# Altium schematic sheet USB.SchDoc
size A3; ApprovedBy: D. Grossman; CheckedBy: G. Engel; Author: Y. Yakov; CompanyName: LightSense; DrawnBy: Y. Yakov; Engineer: Y.Yakov; Organization: LightSense
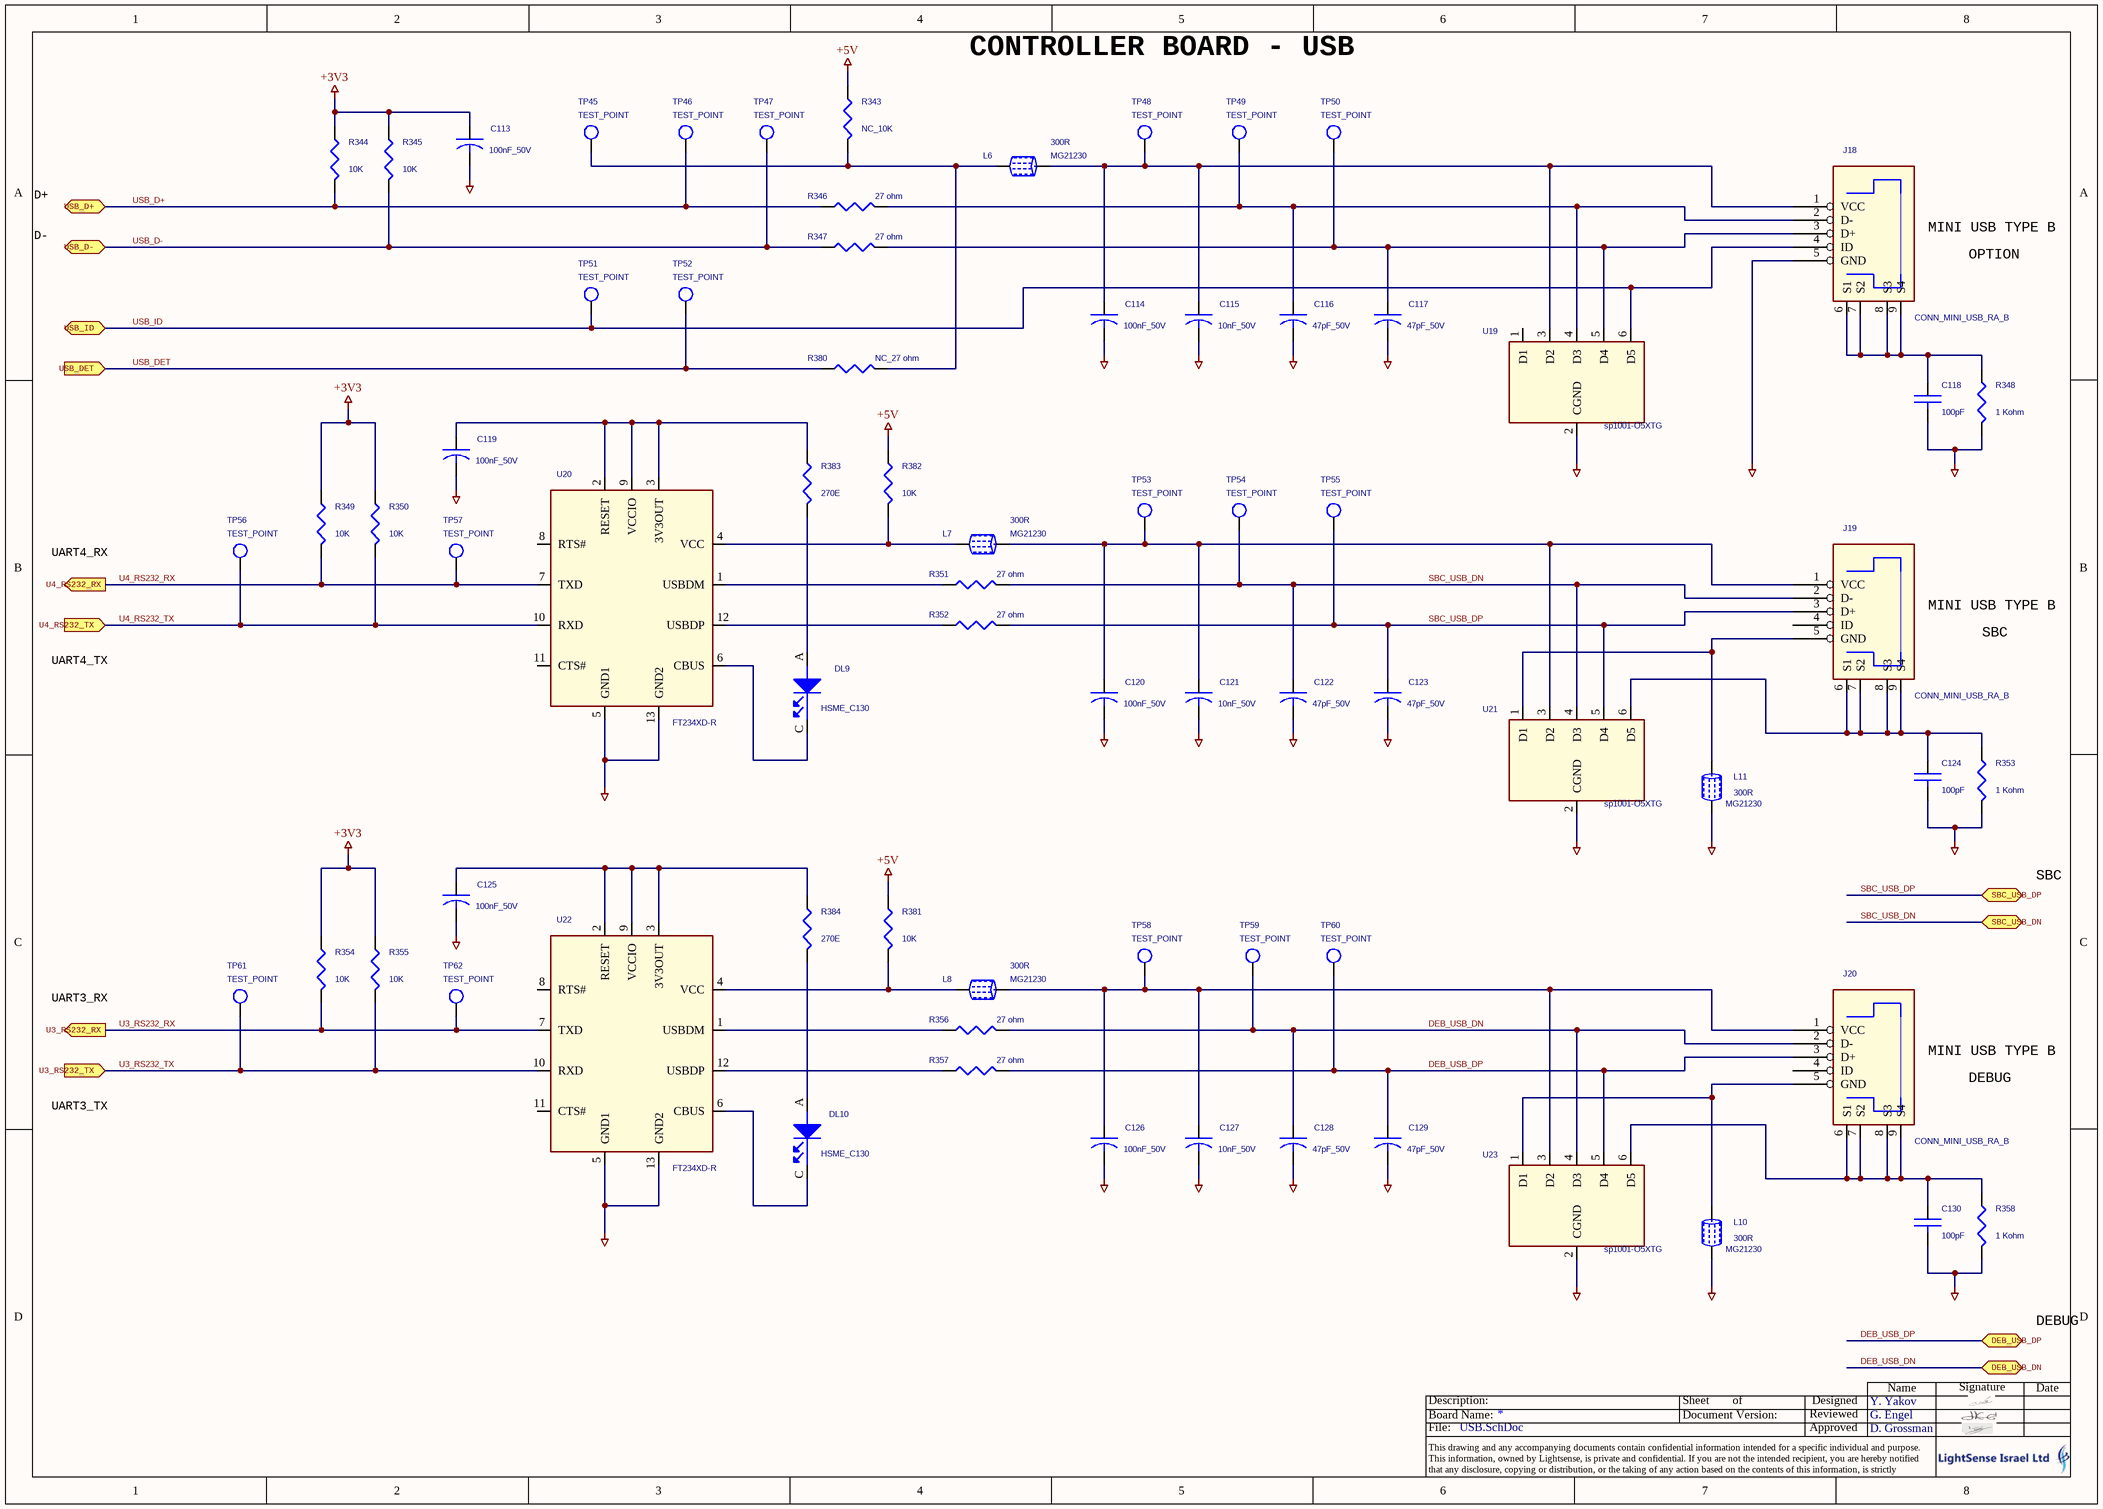
[diagram p0: USB.SchDoc]

## Parts
C113  100nF_50V  [0603]
C114  100nF_50V  [0603]
C115  10nF_50V  [0603]
C116  47pF_50V  [0603]
C117  47pF_50V  [0603]
C118  100pF  [C1206]
C119  100nF_50V  [0603]
C120  100nF_50V  [0603]
C121  10nF_50V  [0603]
C122  47pF_50V  [0603]
C123  47pF_50V  [0603]
C124  100pF  [C1206]
C125  100nF_50V  [0603]
C126  100nF_50V  [0603]
C127  10nF_50V  [0603]
C128  47pF_50V  [0603]
C129  47pF_50V  [0603]
C130  100pF  [C1206]
DL9  HSME_C130  [LED_0603]
DL10  HSME_C130  [LED_0603]
J18  CONN_MINI_USB_RA_B  [MUSB_B_9PIN]
J19  CONN_MINI_USB_RA_B  [MUSB_B_9PIN]
J20  CONN_MINI_USB_RA_B  [MUSB_B_9PIN]
L6  300R  Part_Number: MG21230  [B0603]
L7  300R  Part_Number: MG21230  [B0603]
L8  300R  Part_Number: MG21230  [B0603]
L10  300R  Part_Number: MG21230  [B0603]
L11  300R  Part_Number: MG21230  [B0603]
R343  NC_10K  [0603]
R344  10K  [0603]
R345  10K  [0603]
R346  27 ohm  [R0603]
R347  27 ohm  [R0603]
R348  1 Kohm  [R1206]
R349  10K  [0603]
R350  10K  [0603]
R351  27 ohm  [R0603]
R352  27 ohm  [R0603]
R353  1 Kohm  [R1206]
R354  10K  [0603]
R355  10K  [0603]
R356  27 ohm  [R0603]
R357  27 ohm  [R0603]
R358  1 Kohm  [R1206]
R380  NC_27 ohm  [R0603]
R381  10K  [0603]
R382  10K  [0603]
R383  270E  [0603]
R384  270E  [0603]
TP45  TEST_POINT  [TH_1mm]
TP46  TEST_POINT  [TH_1mm]
TP47  TEST_POINT  [TH_1mm]
TP48  TEST_POINT  [TH_1mm]
TP49  TEST_POINT  [TH_1mm]
TP50  TEST_POINT  [TH_1mm]
TP51  TEST_POINT  [TH_1mm]
TP52  TEST_POINT  [TH_1mm]
TP53  TEST_POINT  [TH_1mm]
TP54  TEST_POINT  [TH_1mm]
TP55  TEST_POINT  [TH_1mm]
TP56  TEST_POINT  [TH_1mm]
TP57  TEST_POINT  [TH_1mm]
TP58  TEST_POINT  [TH_1mm]
TP59  TEST_POINT  [TH_1mm]
TP60  TEST_POINT  [TH_1mm]
TP61  TEST_POINT  [TH_1mm]
TP62  TEST_POINT  [TH_1mm]
U19  sp1001-O5XTG  [SOT_563]
U20  FT234XD-R  [DFN_13]
U21  sp1001-O5XTG  [SOT_563]
U22  FT234XD-R  [DFN_13]
U23  sp1001-O5XTG  [SOT_563]

## Ports
DEB_USB_DN (bidir), DEB_USB_DP (bidir), SBC_USB_DN (bidir), SBC_USB_DP (bidir), U3_RS232_RX (out), U3_RS232_TX (in), U4_RS232_RX (out), U4_RS232_TX (in), USB_D+ (bidir), USB_D- (bidir), USB_DET (in), USB_ID (bidir)

## Nets
+3V3: C113.1 R344.1 R345.1 R349.1 R350.1 R354.1 R355.1
+5V: R343.1 R381.1 R382.1
GND_CPU: C113.2 C114.2 C115.2 C116.2 C117.2 C118.2 C119.2 C120.2 C121.2 C122.2 C123.2 C124.2 C125.2 C126.2 C127.2 C128.2 C129.2 C130.2 J18.5(GND) L10.1 L11.1 R348.2 R353.2 R358.2 U19.2(CGND) U20.5(GND1) U20.13(GND2) U21.2(CGND) U22.5(GND1) U22.13(GND2) U23.2(CGND)
DEB_USB_DN: C128.1 J20.2(D-) R356.2 TP59.1(TP) U23.4(D3) ; port DEB_USB_DN
DEB_USB_DP: C129.1 J20.3(D+) R357.2 TP60.1(TP) U23.5(D4) ; port DEB_USB_DP
SBC_USB_DN: C122.1 J19.2(D-) R351.2 TP54.1(TP) U21.4(D3) ; port SBC_USB_DN
SBC_USB_DP: C123.1 J19.3(D+) R352.2 TP55.1(TP) U21.5(D4) ; port SBC_USB_DP
U3_RS232_RX: R354.2 TP62.1(TP) U22.7(TXD) ; port U3_RS232_RX
U3_RS232_TX: R355.2 TP61.1(TP) U22.10(RXD) ; port U3_RS232_TX
U4_RS232_RX: R349.2 TP57.1(TP) U20.7(TXD) ; port U4_RS232_RX
U4_RS232_TX: R350.2 TP56.1(TP) U20.10(RXD) ; port U4_RS232_TX
USB_D+: R344.2 R346.1 TP46.1(TP) ; port USB_D+
USB_D-: R345.2 R347.1 TP47.1(TP) ; port USB_D-
USB_DET: R380.1 TP52.1(TP) ; port USB_DET
USB_ID: J18.4(ID) TP51.1(TP) U19.6(D5) ; port USB_ID
NetC114_1: C114.1 C115.1 J18.1(VCC) L6.2 TP48.1(TP) U19.3(D2)
NetC116_1: C116.1 J18.2(D-) R346.2 TP49.1(TP) U19.4(D3)
NetC117_1: C117.1 J18.3(D+) R347.2 TP50.1(TP) U19.5(D4)
NetC118_1: C118.1 J18.6(S1) J18.7(S2) J18.8(S3) J18.9(S4) R348.1
NetC119_1: C119.1 R383.1 U20.2(RESET) U20.3(3V3OUT) U20.9(VCCIO)
NetC120_1: C120.1 C121.1 J19.1(VCC) L7.2 TP53.1(TP) U21.3(D2)
NetC124_1: C124.1 J19.6(S1) J19.7(S2) J19.8(S3) J19.9(S4) R353.1 U21.6(D5)
NetC125_1: C125.1 R384.1 U22.2(RESET) U22.3(3V3OUT) U22.9(VCCIO)
NetC126_1: C126.1 C127.1 J20.1(VCC) L8.2 TP58.1(TP) U23.3(D2)
NetC130_1: C130.1 J20.6(S1) J20.7(S2) J20.8(S3) J20.9(S4) R358.1 U23.6(D5)
NetDL9_A: DL9.A(ANODE) R383.2
NetDL9_C: DL9.C(CATHODE) U20.6(CBUS)
NetDL10_A: DL10.A(ANODE) R384.2
NetDL10_C: DL10.C(CATHODE) U22.6(CBUS)
NetJ19_5: J19.5(GND) L11.2 U21.1(D1)
NetJ20_5: J20.5(GND) L10.2 U23.1(D1)
NetL6_1: L6.1 R343.2 R380.2 TP45.1(TP)
NetL7_1: L7.1 R382.2 U20.4(VCC)
NetL8_1: L8.1 R381.2 U22.4(VCC)
NetR351_1: R351.1 U20.1(USBDM)
NetR352_1: R352.1 U20.12(USBDP)
NetR356_1: R356.1 U22.1(USBDM)
NetR357_1: R357.1 U22.12(USBDP)

Not connected (* = marked no-connect by the designer): J19 4(ID); J20 4(ID); U19 1(D1); U20 8(RTS#) 11(CTS#); U22 8(RTS#) 11(CTS#)

## Notes on the sheet
- CONTROLLER BOARD - USB
- D+
- D-
- (near J18) MINI USB TYPE B
- OPTION
- UART4_RX
- (near J19) MINI USB TYPE B
- SBC
- UART4_TX
- UART3_RX
- (near J20) MINI USB TYPE B
- UART3_TX
- DEBUG
- Name
- Signature
- Date
- File:
- Board Name:
- Description:
- Document Version:
- Sheet
- of
- Approved
- Reviewed
- Designed
- This drawing and any accompanying documents contain confidential information intended for a specific individual and purpose.
  This information, owned by Lightsense, is private and confidential. If you are not the intended recipient, you are hereby notified that any disclosure, copying or distribution, or the taking of any action based on the contents of this information, is strictly prohibited.

## Library data of the parts
C113 C115 C116 C121 C122 C127 C128 = C: CAP_SMT_0603_50V_X7R_10%; MFG: KEMET; MFG_PN: C0603C104K5RAC
C114 C117 C119 C120 C123 C125 C126 C129 = C: CAP_SMT_0603_50V_X7R_10%; MFG_PN: C0603C104K5RAC; MFG: KEMET
C118 C124 C130 = C1206: Cap cer 100pF 5% 500V C0G 1206 smd; Part_Number: CP70050; NRX_PN: CE0130300
DL9 DL10 = LED: MFG: AVAGO; Lumenis_P/N: EL0000123; MFG_PN: HSME_C130
J18 = CONN_MINI_USB_RA_B: MFG_PN: MUSB-05-F-B-SM-A-TR; MFG: SAMTEC
J19 J20 = CONN_MINI_USB_RA_B: MFG: SAMTEC; MFG_PN: MUSB-05-F-B-SM-A-TR
L6-L8 L10 L11 = FERRITE BEAD2_0: Chip Bead Z 300 Ohm 0603 RoHS; NRX_PN: LE0010912
R343 R382 R383 = R_Dup1: MFG: YAGEO; MFG_PN: RC0603FR-0710K0L
R344 R345 R381 R384 = R_Dup1: MFG_PN: RC0603FR-0710K0L; MFG: YAGEO
R346 R347 R351 R352 R356 R357 R380 = R0603: Res 330 Ohm 5% 0603 RoHS; Part_Number: RS61410; NRX_PN: RE0100350
R348 R353 R358 = R1206: RES 1 Kohm 1% 1206 RoHS; Part_Number: RS00940; NRX_PN: RE0300400
R349 R354 = R_Dup1: MFG_PN: RC0603FR-0710KL; MFG: YAGEO
R350 R355 = R_Dup1: MFG: YAGEO; MFG_PN: RC0603FR-0710KL
TP45-TP62 = T POINT R_Dup1
U20 U22 = FT234XD-R_1: MFG: FTDI; MFG_PN: FT234XD-R